# Altium schematic sheet Power_Regulator.SchDoc: Power Regulator
size A4; SheetNumber: 2; SheetTotal: 2
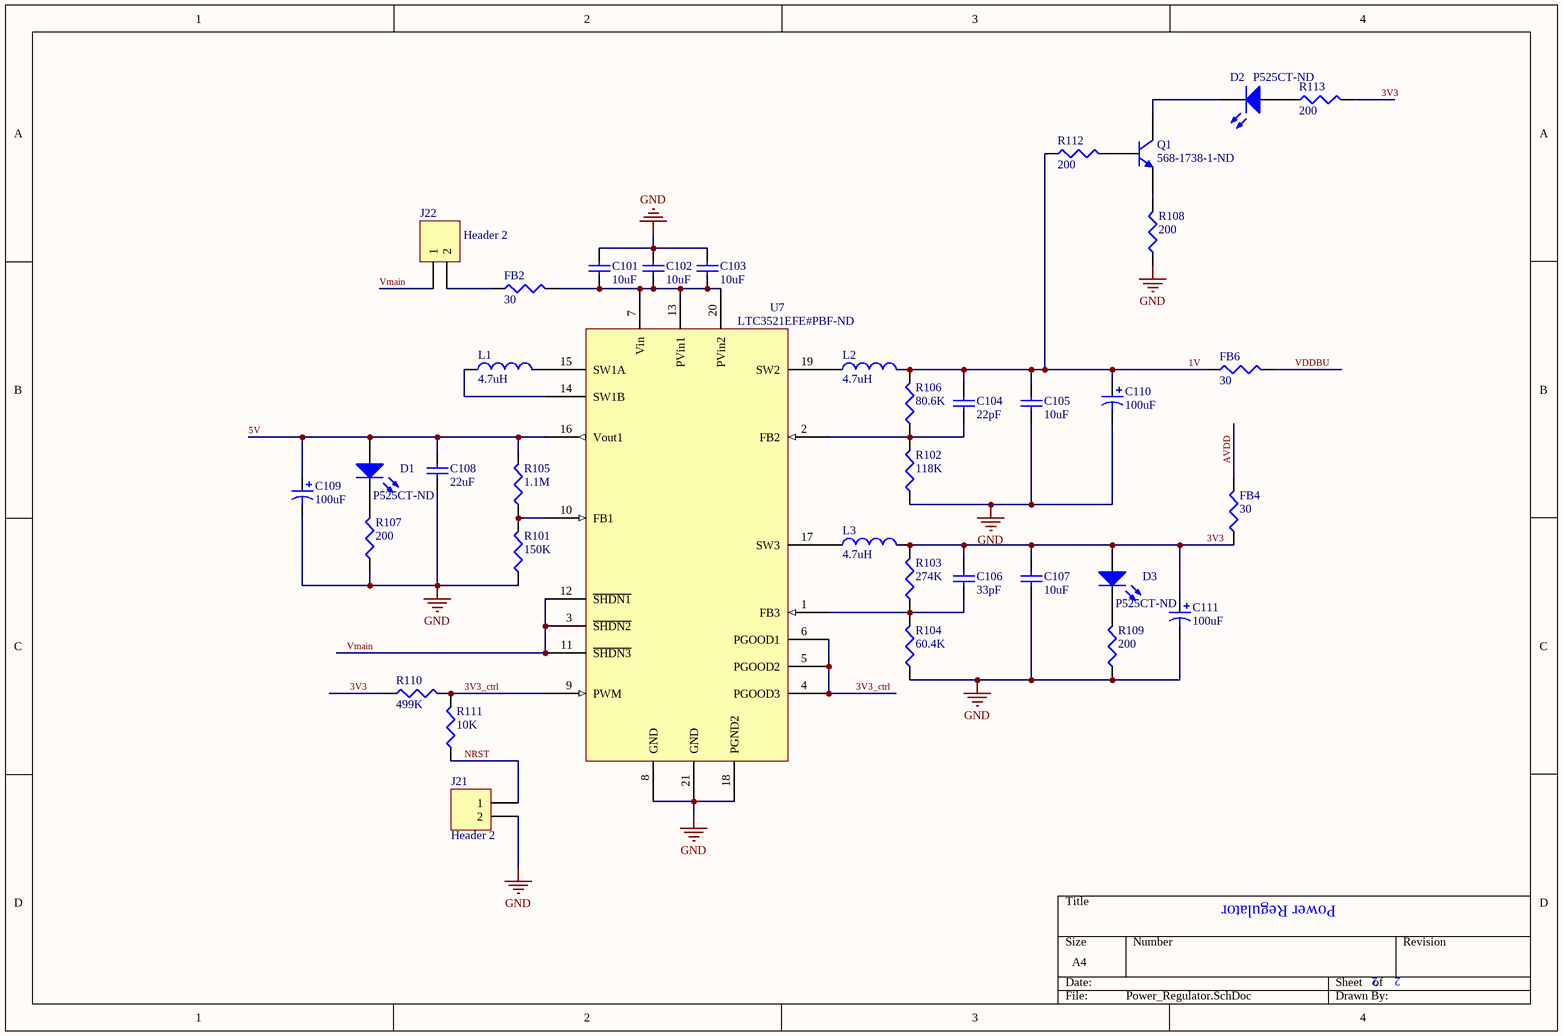
[diagram p0: Power_Regulator.SchDoc]

## Parts
C101  value 10uF  [0805]  (hidden comment: C0805_c_10uF)
C102  value 10uF  [0805]  (hidden comment: C0805_c_10uF)
C103  value 10uF  [0805]  (hidden comment: C0805_c_10uF)
C104  value 22pF  [CAPC2008X06N]  (hidden comment: AVX_0805_a2_22pf)
C105  value 10uF  [0805]  (hidden comment: C0805_c_10uF)
C106  value 33pF  [CAPC2008X06N]  (hidden comment: AVX_0805_a3_33pf)
C107  value 10uF  [0805]  (hidden comment: C0805_c_10uF)
C108  value 22uF  [0805]  (hidden comment: C0805_c_22uF)
C109  value 100uF  [6032]  (hidden comment: TantCap_6032_100uF)
C110  value 100uF  [6032]  (hidden comment: TantCap_6032_100uF)
C111  value 100uF  [6032]  (hidden comment: TantCap_6032_100uF)
D1  Supplier Part Number 1: P525CT-ND  [LED]  (hidden comment: LED_Green)
D2  Supplier Part Number 1: P525CT-ND  [LED]  (hidden comment: LED_Green)
D3  Supplier Part Number 1: P525CT-ND  [LED]  (hidden comment: LED_Green)
FB2  Value @ 100MHz: 30  [0805]  (hidden comment: Murata_a_0805_30_Ohm_100Mhz)
FB4  Value @ 100MHz: 30  [0805]  (hidden comment: Murata_a_0805_30_Ohm_100Mhz)
FB6  Value @ 100MHz: 30  [0805]  (hidden comment: Murata_a_0805_30_Ohm_100Mhz)
J21  Header 2  [HDR1X2]
J22  Header 2  [HDR1X2]
L1  value 4.7uH  [L1812]  (hidden comment: L1812_4.7uH)
L2  value 4.7uH  [L1812]  (hidden comment: L1812_4.7uH)
L3  value 4.7uH  [L1812]  (hidden comment: L1812_4.7uH)
Q1  Supplier Part Number 1: 568-1738-1-ND  [SOT95P230X110-3N]  (hidden comment: NPN Transistor)
R101  value 150K  [RES0805]  (hidden comment: Panasonic_0805_b_150K)
R102  value 118K  [RES0805]  (hidden comment: Susumu_0805_c_118K)
R103  value 274K  [RES0805]  (hidden comment: TE_0805_a_274K)
R104  value 60.4K  [RES0805]  (hidden comment: Susumu_0805_a_60.4K)
R105  value 1.1M  [RES0805]  (hidden comment: TE_0805_c_1.1K)
R106  value 80.6K  [RES0805]  (hidden comment: Susumu_0805_b_80.6K)
R107  value 200  [RES0805]  (hidden comment: Susumu_0805_a3_200)
R108  value 200  [RES0805]  (hidden comment: Susumu_0805_a3_200)
R109  value 200  [RES0805]  (hidden comment: Susumu_0805_a3_200)
R110  value 499K  [RES0805]  (hidden comment: Susumu_0805_c3_499K)
R111  value 10K  [RES0805]  (hidden comment: Susumu_0805_b2_10K)
R112  value 200  [RES0805]  (hidden comment: Susumu_0805_a3_200)
R113  value 200  [RES0805]  (hidden comment: Susumu_0805_a3_200)
U7  Supplier Part Number 1: LTC3521EFE#PBF-ND  [LTC3521EFE#PBF - duplicate]  (hidden comment: LTC3521EFE#PBF)

## Nets
GND: C101.2 C102.2 C103.2 C105.1 C107.1 C108.1 C109.2 C110.2 C111.2 J21.2 R101.1 R102.1 R104.1 R107.1 R108.1 R109.1 U7.8(GND) U7.18(PGND2) U7.21(GND)
1V: C104.2 C105.2 C110.1 FB6.1 L2.2 R106.2 R112.1
3V3: C106.2 C107.2 C111.1 D3.1(A) FB4.1 L3.2 R103.2 R110.1 R113.2
3V3_ctrl: R110.2 R111.2 U7.4(PGOOD3) U7.5(PGOOD2) U7.6(PGOOD1) U7.9(PWM)
5V: C108.2 C109.1 D1.1(A) R105.2 U7.16(Vout1)
AVDD: FB4.2
NRST: J21.1 R111.1
VDDBU: FB6.2
Vmain: J22.1 U7.3(~{SHDN2}) U7.11(~{SHDN3}) U7.12(~{SHDN1})
NetC101_1: C101.1 C102.1 C103.1 FB2.2 U7.7(Vin) U7.13(PVin1) U7.20(PVin2)
NetC104_1: C104.1 R102.2 R106.1 U7.2(FB2)
NetC106_1: C106.1 R103.1 R104.2 U7.1(FB3)
NetD1_2: D1.2(K) R107.2
NetD2_1: D2.1(A) R113.1
NetD2_2: D2.2(K) Q1.3(C)
NetD3_2: D3.2(K) R109.2
NetFB2_1: FB2.1 J22.2
NetL1_1: L1.1 U7.14(SW1B)
NetL1_2: L1.2 U7.15(SW1A)
NetL2_1: L2.1 U7.19(SW2)
NetL3_1: L3.1 U7.17(SW3)
NetQ1_1: Q1.1(B) R112.2
NetQ1_2: Q1.2(E) R108.2
NetR101_2: R101.2 R105.1 U7.10(FB1)

## Library data of the parts
C101-C103 C105 C107 = C0805_c_10uF: Ceramic Chip Capacitor - 10uF; Note: Footprint corresponds to dimensions for bulk cassette packaging. This case size has tightened tolerances.; Published: 17-Jul-2002; LatestRevisionDate: 19-Mar-2004; LatestRevisionNote: Silkscreen size reduced.; DatasheetDocument: Mar-2001; PackageDocument: Mar-2001; PackageReference: 0805; Publisher: Altium Limited; Code_JEITA: 0805; Code_IPC: 2012[0805]; ComponentLink1Description: Manufacturer Link; ComponentLink1URL: http://www.kemet.com/; ComponentLink2Description: Datasheet; ComponentLink2URL: http://www.kemet.com/kemet/web/homepage/kechome.nsf/vapubfilesname/F3102TA.pdf/$file/F3102TA.pdf; Supplier 1: Digi-Key; Supplier Part Number 1: 587-1299-1-ND
C104 = AVX_0805_a2_22pf: CAP CER 22PF 50V 5% NP0 0805; Supplier 1: Digi-Key; Supplier Part Number 1: 478-1308-1-ND
C106 = AVX_0805_a3_33pf: CAP CER 33PF 50V 5% NP0 0805; Supplier 1: Digi-Key; Supplier Part Number 1: 478-1310-1-ND
C108 = C0805_c_22uF: Ceramic Chip Capacitor - 22uF; Note: Footprint corresponds to dimensions for bulk cassette packaging. This case size has tightened tolerances.; Published: 17-Jul-2002; LatestRevisionDate: 19-Mar-2004; LatestRevisionNote: Silkscreen size reduced.; DatasheetDocument: Mar-2001; PackageDocument: Mar-2001; PackageReference: 0805; Publisher: Altium Limited; Code_JEITA: 0805; Code_IPC: 2012[0805]; ComponentLink1Description: Manufacturer Link; ComponentLink1URL: http://www.kemet.com/; ComponentLink2Description: Datasheet; ComponentLink2URL: http://www.kemet.com/kemet/web/homepage/kechome.nsf/vapubfilesname/F3102TA.pdf/$file/F3102TA.pdf; Supplier 1: Digi-Key; Supplier Part Number 1: 587-1468-1-ND
C109-C111 = TantCap_6032_100uF: CAP TANT 100UF 10V 10% LOESR SMD; Code_JEITA: 6032; ComponentLink1Description: Manufacturer Link; ComponentLink1URL: http://www.kemet.com; ComponentLink2Description: Datasheet; ComponentLink2URL: http://www.kemet.com/kemet/web/homepage/kechome.nsf/vapubfiles/B45197A_SpeedPower.pdf/$file/B45197A_SpeedPower.pdf; Supplier 1: Digi-Key; Supplier Part Number 1: 495-1528-1-ND
D1-D3 = LED_Green: LED GREEN HI BRT SS TYPE LO CUR; Manufacturer: Panasonic; Colour: green; Supplier 1: Digi-Key
FB2 FB4 FB6 = Murata_a_0805_30_Ohm_100Mhz: FERRITE CHIP 30 OHM 3000MA 0805; Supplier 1: Digi-Key; Supplier Part Number 1: 490-1052-1-ND
J21 J22 = Header 2: Header, 2-Pin; LatestRevisionDate: 17-Jul-2002; LatestRevisionNote: Re-released for DXP Platform.; Publisher: Altium Limited
L1-L3 = L1812_4.7uH: Inductor unshielded 4.7mH 1812 SMD; ComponentLink1Description: Manufacturer Link; ComponentLink1URL: http://www.delevan.com; ComponentLink2Description: Datasheet; ComponentLink2URL: http://www.delevan.com/seriesPDFs/1812.pdf; Supplier 1: Digi-Key; Supplier Part Number 1: DN42135JCT-ND
Q1 = NPN Transistor: NPN Transistor, SMD; ComponentLink1Description: Manufacturer Link; ComponentLink1URL: http://www.nxp.com/; ComponentLink2Description: Datasheet; ComponentLink2URL: http://www.nxp.com/documents/data_sheet/PMBT2222_2222A.pdf; Type: NPN; Supplier 1: Digi-Key
R101 = Panasonic_0805_b_150K: RES 150K OHM 1/8W .1% 0805 SMD; Supplier 1: Digi-Key; Supplier Part Number 1: P150KDACT-ND
R102 = Susumu_0805_c_118K: RES 118K OHM 1/10W .5% 0805 SMD; Supplier 1: Digi-Key; Supplier Part Number 1: RR12P118KDCT-ND
R103 = TE_0805_a_274K: RES 274K OHM 1/10W 0.1% 0805; Supplier 1: Digi-Key; Supplier Part Number 1: A103383CT-ND
R104 = Susumu_0805_a_60.4K: RES 60.4K OHM 1/10W .5% 0805 SMD; Supplier 1: Digi-Key; Supplier Part Number 1: RR12P60.4KDCT-ND
R105 = TE_0805_c_1.1K: RES 1.1M OHM 1/16W 0.1% 0805; Supplier 1: Digi-Key; Supplier Part Number 1: A103796CT-ND
R106 = Susumu_0805_b_80.6K: RES 80.6K OHM 1/10W .5% 0805 SMD; Supplier 1: Digi-Key; Supplier Part Number 1: RR12P80.6KDCT-ND
R107-R109 R112 R113 = Susumu_0805_a3_200: RES 200 OHM 1/10W .5% 0805 SMD; Supplier 1: Digi-Key; Supplier Part Number 1: RR12P200DCT-ND
R110 = Susumu_0805_c3_499K: RES 499K OHM 1/10W .5% 0805 SMD; Supplier 1: Digi-Key; Supplier Part Number 1: RR12P499KDCT-ND
R111 = Susumu_0805_b2_10K: RES 10.0K OHM 1/10W .5% 0805 SMD; Supplier 1: Digi-Key; Supplier Part Number 1: RR12P10.0KDCT-ND
U7 = LTC3521EFE#PBF: IC BUCK BOOST SYNC ADJ 20TSSOP; ComponentLink1Description: Manufacturer Link; ComponentLink1URL: http://www.linear.com/; ComponentLink2Description: Datasheet; ComponentLink2URL: http://cds.linear.com/docs/en/datasheet/3521fb.pdf; Supplier 1: Digi-Key